# EAGLE schematic PCB Design (EAGLE 9.6.2)
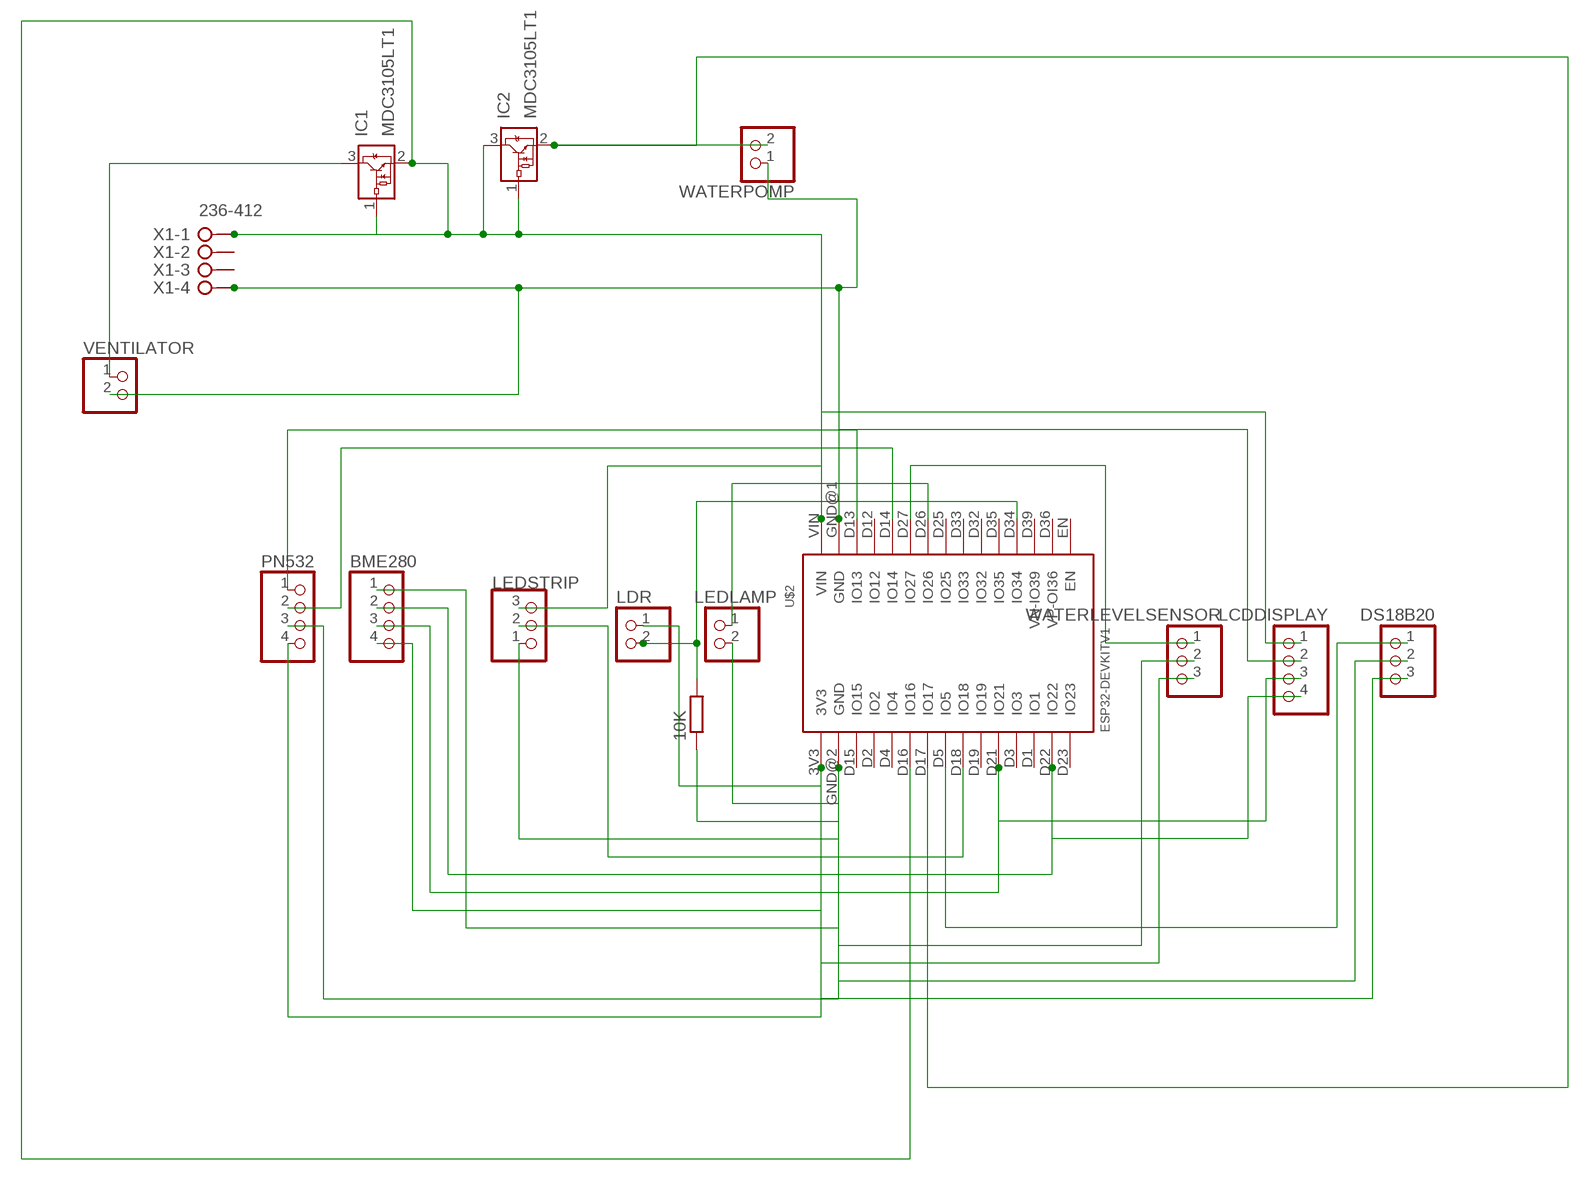
[diagram p0: schematic, sheet 1]

## Parts
10K  R-EU_0204/7  [0204/7]
BME280  PINHD-1X4  [1X04]
DS18B20  PINHD-1X3  [1X03]
IC1  MDC3105LT1  [SOT23]
IC2  MDC3105LT1  [SOT23]
LCDDISPLAY  PINHD-1X4  [1X04]
LDR  PINHD-1X2  [1X02]
LEDLAMP  PINHD-1X2  [1X02]
LEDSTRIP  PINHD-1X3  [1X03]
PN532  PINHD-1X4  [1X04]
U$2  ESP32DEVKITV1  [ESP32-DEVKITV1]
VENTILATOR  PINHD-1X2  [1X02]
WATERLEVELSENSOR  PINHD-1X3  [1X03]
WATERPOMP  PINHD-1X2  [1X02]
X1  236-412  [236-412]

## Nets
N$1: IC1.1(VIN) IC1.2(GND) IC2.1(VIN) IC2.3(VOUT) LCDDISPLAY.1 LEDSTRIP.3 U$2.D16(IO16) U$2.VIN X1.1@1(-1:KL1)
N$2: LCDDISPLAY.2 U$2.GND@1(GND) VENTILATOR.2 WATERPOMP.1 X1.4@1(-4:KL1)
N$3: IC1.3(VOUT) VENTILATOR.1
N$4: IC2.2(GND) U$2.D17(IO17) WATERPOMP.2
N$5: LEDLAMP.1 U$2.D26(IO26)
N$6: 10K.1 BME280.1 DS18B20.2 LEDLAMP.2 LEDSTRIP.1 PN532.3 U$2.GND@2(GND) WATERLEVELSENSOR.2
N$7: BME280.4 DS18B20.3 LDR.1 PN532.4 U$2.3V3 WATERLEVELSENSOR.3
N$8: 10K.2 LDR.2 U$2.D34(IO34)
N$9: PN532.1 U$2.D13(IO13)
N$10: BME280.3 LCDDISPLAY.3 U$2.D21(IO21)
N$11: LEDSTRIP.2 U$2.D18(IO18)
N$12: PN532.2 U$2.D14(IO14)
N$13: BME280.2 LCDDISPLAY.4 U$2.D22(IO22)
N$15: U$2.D27(IO27) WATERLEVELSENSOR.1
N$17: DS18B20.1 U$2.D5(IO5)
Unconnected: U$2.D1(IO1) U$2.D2(IO2) U$2.D3(IO3) U$2.D4(IO4) U$2.D12(IO12) U$2.D15(IO15) U$2.D19(IO19) U$2.D23(IO23) U$2.D25(IO25) U$2.D32(IO32) U$2.D33(IO33) U$2.D35(IO35) U$2.D36(VP-OI36) U$2.D39(VN-IO39) U$2.EN X1.1@2(-1:KL2) X1.2@1(-2:KL1) X1.2@2(-2:KL2) X1.3@1(-3:KL1) X1.3@2(-3:KL2) X1.4@2(-4:KL2) X1.5@1(-5:KL1) X1.5@2(-5:KL2) X1.6@1(-6:KL1) X1.6@2(-6:KL2) X1.7@1(-7:KL1) X1.7@2(-7:KL2) X1.8@1(-8:KL1) X1.8@2(-8:KL2) X1.9@1(-9:KL1) X1.9@2(-9:KL2) X1.10@1(-10:KL1) X1.10@2(-10:KL2) X1.11@1(-11:KL1) X1.11@2(-11:KL2) X1.12@1(-12:KL1) X1.12@2(-12:KL2)

## Library data of the parts
10K = rcl:R-EU_: RESISTOR, European symbol; SPICEPREFIX: R
BME280 LCDDISPLAY PN532 = pinhead:PINHD-1X4: PIN HEADER
DS18B20 LEDSTRIP WATERLEVELSENSOR = pinhead:PINHD-1X3: PIN HEADER
IC1 IC2 = on-semiconductor:MDC3105LT1: Integrated Relay, Inductive Load Driver Sopurce: U6 OnSemi Inductive Load Driver MDC3105-D.PDF; MF: ON SEMICONDUCTOR; MPN: MDC3105LT1; OC_FARNELL: 1126459; OC_NEWARK: 16F6132
LDR LEDLAMP VENTILATOR WATERPOMP = pinhead:PINHD-1X2: PIN HEADER
U$2 = ESP32-DEVKITV1:ESP32DEVKITV1
X1 = con-wago-508:236-412: Terminal Strips 2.5 mm2/AWG 12, Series 236, Pin Spacings 5/5.08 mm Source: Data sheet <http://www.farnell.com/datasheets/63479.pdf>; MF: Wago Corporation; MPN: 0236-0412; OC_FARNELL: 1283531; OC_NEWARK: 79K2064